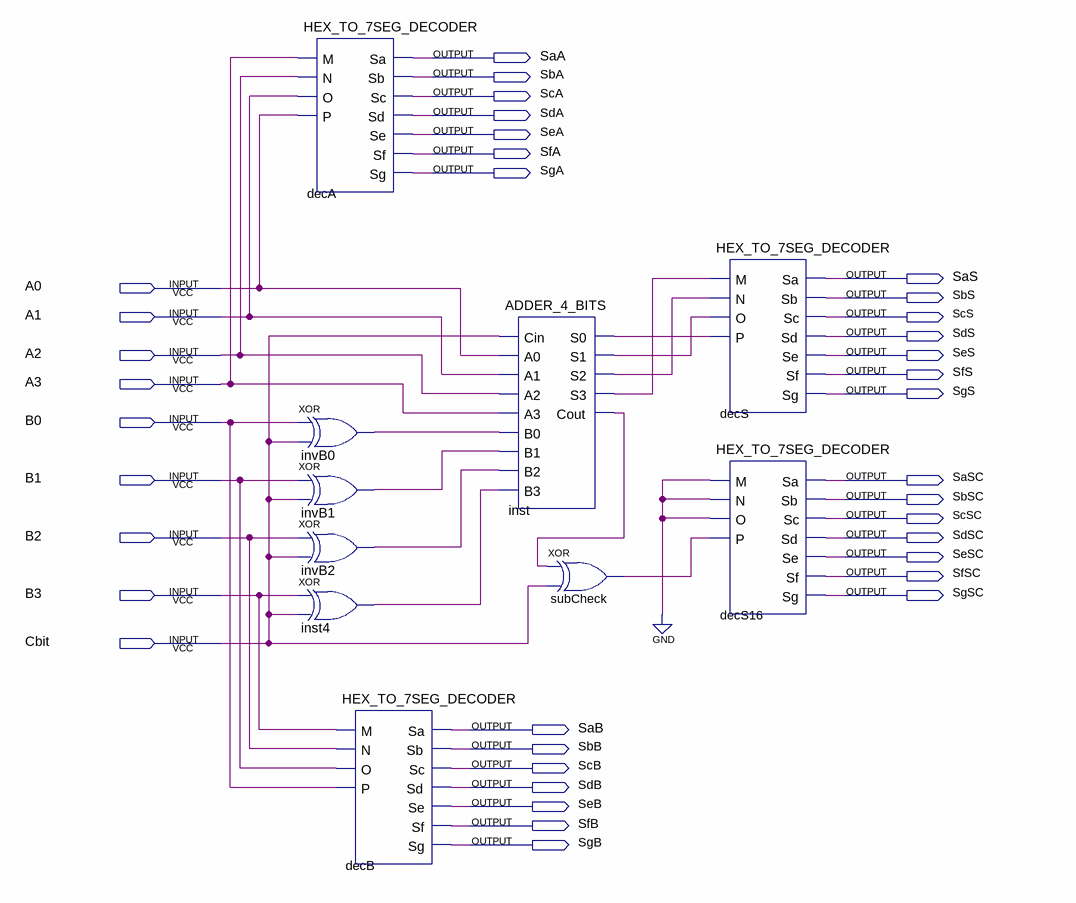
[diagram p0: schematic sheet]
// Quartus schematic Full_Adder_Subtractor.bdf as structural Verilog: 10 symbols, 37 pins
module Full_Adder_Subtractor (
  input  A0,
  input  A1,
  input  A2,
  input  A3,
  input  B0,
  input  B1,
  input  B2,
  input  B3,
  input  Cbit,
  output SaA,
  output SbA,
  output ScA,
  output SdA,
  output SeA,
  output SfA,
  output SgA,
  output SaS,
  output SbS,
  output ScS,
  output SdS,
  output SeS,
  output SfS,
  output SgS,
  output SaSC,
  output SbSC,
  output ScSC,
  output SdSC,
  output SeSC,
  output SfSC,
  output SgSC,
  output SaB,
  output SbB,
  output ScB,
  output SdB,
  output SeB,
  output SfB,
  output SgB
);

  wire inst4_out, inst_cout, inst_s0, inst_s1, inst_s2, inst_s3, invB0_out, invB1_out, invB2_out,
       subCheck_out;

  HEX_TO_7SEG_DECODER decA (
    .M(A3), .N(A2), .O(A1), .P(A0), .Sa(SaA), .Sb(SbA), .Sc(ScA), .Sd(SdA), .Se(SeA), .Sf(SfA), .Sg(SgA));
  xor invB0 (invB0_out, B0, Cbit);
  xor invB1 (invB1_out, B1, Cbit);
  xor invB2 (invB2_out, B2, Cbit);
  xor inst4 (inst4_out, B3, Cbit);
  HEX_TO_7SEG_DECODER decB (
    .M(B3), .N(B2), .O(B1), .P(B0), .Sa(SaB), .Sb(SbB), .Sc(ScB), .Sd(SdB), .Se(SeB), .Sf(SfB), .Sg(SgB));
  ADDER_4_BITS inst (
    .Cin(Cbit), .A0(A0), .A1(A1), .A2(A2), .A3(A3), .B0(invB0_out), .B1(invB1_out), .B2(invB2_out),
    .B3(inst4_out), .S0(inst_s0), .S1(inst_s1), .S2(inst_s2), .S3(inst_s3), .Cout(inst_cout));
  xor subCheck (subCheck_out, inst_cout, Cbit);
  HEX_TO_7SEG_DECODER decS (
    .M(inst_s3), .N(inst_s2), .O(inst_s1), .P(inst_s0), .Sa(SaS), .Sb(SbS), .Sc(ScS), .Sd(SdS), .Se(SeS),
    .Sf(SfS), .Sg(SgS));
  HEX_TO_7SEG_DECODER decS16 (
    .M(1'b0), .N(1'b0), .O(1'b0), .P(subCheck_out), .Sa(SaSC), .Sb(SbSC), .Sc(ScSC), .Sd(SdSC), .Se(SeSC),
    .Sf(SfSC), .Sg(SgSC));
endmodule
